# EAGLE design ble_terrain_twister (EAGLE 8.3.2)
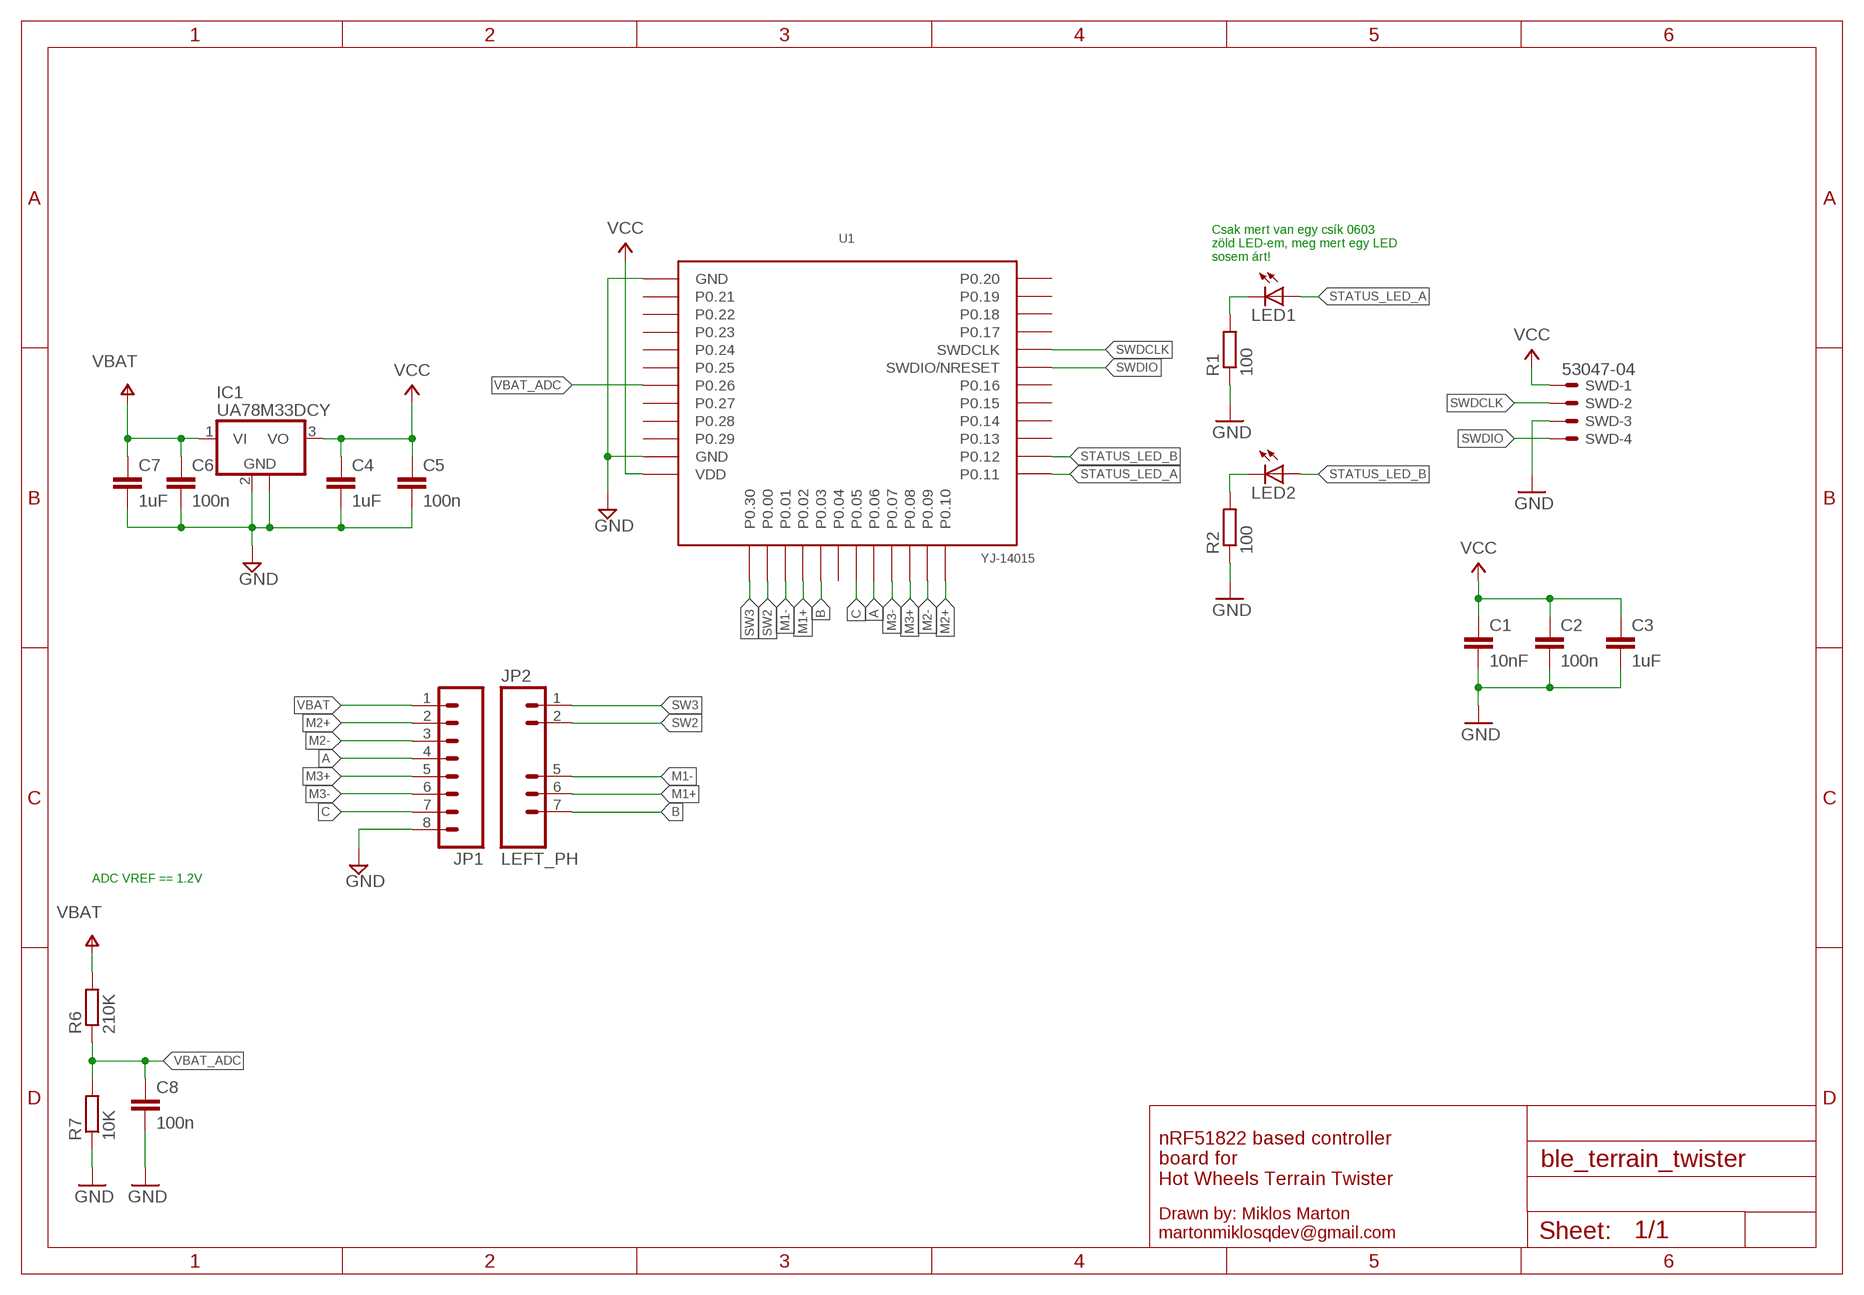
[diagram p0: schematic, sheet 1]

## Parts
C1  10nF  C-EUC0603  [C0603]
C2  100n  C-EUC0603  [C0603]
C3  1uF  C-EUC0603  [C0603]
C4  1uF  C-EUC0603  [C0603]
C5  100n  C-EUC0603  [C0603]
C6  100n  C-EUC0603  [C0603]
C7  1uF  C-EUC0603  [C0603]
C8  100n  C-EUC0603  [C0603]
IC1  UA78M33DCY  [SOT223]
JP1  M081.27MM  [1X08_1.27MM]
JP2  LEFT_PH  [1X08_1.27MM]
LED1  LED0603  [CHIPLED_0603]
LED2  LED0603  [CHIPLED_0603]
R1  100  R-EU_R0603  [R0603]
R2  100  R-EU_R0603  [R0603]
R6  210K  R-EU_R0603  [R0603]
R7  10K  R-EU_R0603  [R0603]
SWD  53047-04  [53047-04]
U1  YJ-14015  [YJ-14015]

## Nets
A: JP1.4 U1.P.06(P0.06)
B: JP2.7 U1.P.03(P0.03)
C: JP1.7 U1.P.05(P0.05)
GND: C1.2 C2.2 C3.2 C4.2 C5.2 C6.2 C7.2 C8.2 IC1.2(GND) IC1.4(GND) JP1.8 R1.1 R2.1 R7.1 SWD.3 U1.GND U1.GND@2(GND)
LED_A_R: LED1.C R1.2
LED_B_R: LED2.C R2.2
M1+: JP2.6 U1.P.02(P0.02)
M1-: JP2.5 U1.P.01(P0.01)
M2+: JP1.2 U1.P.10(P0.10)
M2-: JP1.3 U1.P.09(P0.09)
M3+: JP1.5 U1.P.08(P0.08)
M3-: JP1.6 U1.P.07(P0.07)
STATUS_LED_A: LED1.A U1.P.11(P0.11)
STATUS_LED_B: LED2.A U1.P.12(P0.12)
SW2: JP2.2 U1.P.00(P0.00)
SW3: JP2.1 U1.P.30(P0.30)
SWDCLK: SWD.2 U1.SWDCLK
SWDIO: SWD.4 U1.SWDIO(SWDIO/NRESET)
VBAT: C6.1 C7.1 IC1.1(VI) JP1.1 R6.2
VBAT_ADC: C8.1 R6.1 R7.2 U1.P.26(P0.26)
VCC: C1.1 C2.1 C3.1 C4.1 C5.1 IC1.3(VO) SWD.1 U1.VDD
Unconnected: U1.P.04(P0.04) U1.P.13(P0.13) U1.P.14(P0.14) U1.P.15(P0.15) U1.P.16(P0.16) U1.P.17(P0.17) U1.P.18(P0.18) U1.P.19(P0.19) U1.P.20(P0.20) U1.P.21(P0.21) U1.P.22(P0.22) U1.P.23(P0.23) U1.P.24(P0.24) U1.P.25(P0.25) U1.P.27(P0.27) U1.P.28(P0.28) U1.P.29(P0.29)

## Notes on the sheet
- Csak mert van egy csík 0603 
  zöld LED-em, meg mert egy LED
  sosem árt!
- ADC VREF == 1.2V
- nRF51822 based controller 
  board for 
  Hot Wheels Terrain Twister

## Library data of the parts
C1-C8 = rcl:C-EU: CAPACITOR, European symbol
IC1 = linear:UA78M*: POSITIVE-VOLTAGE REGULATORS Source: http://focus.ti.com/lit/ds/symlink/ua78m33.pdf
JP1 = SparkFun:M08: Header 8 Standard 8-pin 0.1" header. Use with straight break away headers (SKU : PRT-00116), right angle break away headers (PRT-00553), swiss pins (PRT-00743), machine pins (PRT-00117), and female headers (PRT-00115).
JP2 = terrain_twister_control_board_edge:LEFT_PH
LED1 LED2 = CEDT:LED
R1 R2 R6 R7 = rcl:R-EU_: RESISTOR, European symbol
SWD = con-molex:53?-04: CONNECTOR wire to board 1.25 mm (.049 inch) pitch header; MF: WALDOM/MOLEX; MPN: 53047-0410; OC_FARNELL: 9733060; OC_NEWARK: 38C9900
U1 = YJ-14015:YJ-14015

## Board
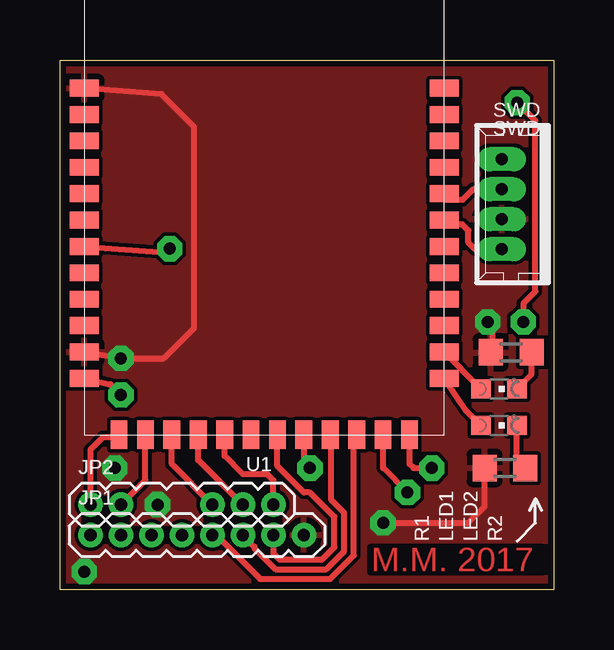
[diagram p1: board, top side]
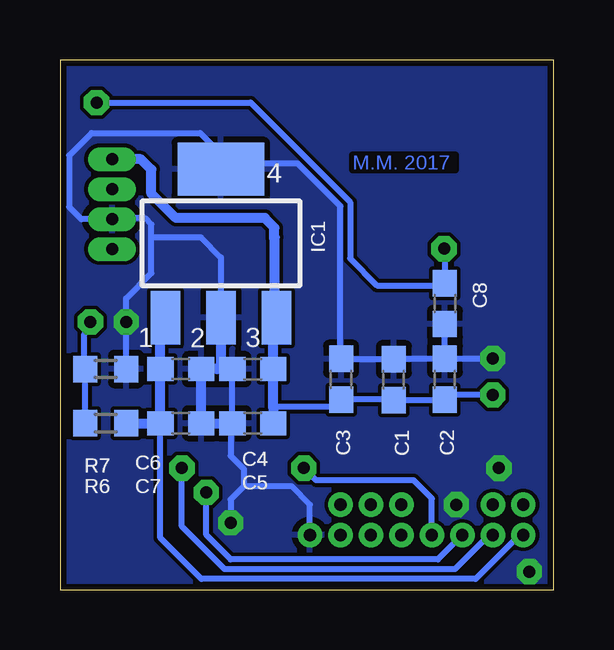
[diagram p2: board, bottom side, seen from below]

Size 20.57 x 22.1 mm. Coordinates in mm from the lower left corner, seen from the top.
Outline: 0,22.1 20.57,22.1 20.57,0 0,0 0,22.1
Copper layers (1*16): Top 0.035mm / dielectric 1.5mm / Bottom 0.035mm
Design rules "dirt_cheap_dirty_boards.v1": minimum track width 5mil, minimum drill 0.3mm, track to track 6mil, track to pad 6mil, pad to pad 6mil, via to via 6mil, smd to smd 0mil, copper to edge 10mil, drill to drill 10mil, minimum pad ring 10mil, minimum via ring 6mil, stop-mask expansion 2mil, vias tented up to drill 25mil, thermal gap 10mil

### Footprints (pad centres in the part's own frame; a part is rotated, then mirrored left to right if it is on the bottom)
C0603 = smd 1.1 x 1: 1 -0.85,0; 2 0.85,0
SOT223 = smd 1.219 x 2.235: 1 -2.311,-3.099; 2 0,-3.099; 3 2.311,-3.099 | smd 3.6 x 2.2: 4 0,3.099
1X08_1.27MM = drill 0.508 pad 1: 1 0,0; 2 1.27,0; 3 2.54,0; 4 3.81,0; 5 5.08,0; 6 6.35,0; 7 7.62,0; 8 8.89,0
1X08_1.27MM' = drill 0.508 pad 1: 1 0,0; 2 1.27,0; 5 5.08,0; 6 6.35,0; 7 7.62,0
CHIPLED_0603 = smd 0.8 x 0.8: A 0,-0.75; C 0,0.75
R0603 = smd 1 x 1.1: 1 -0.85,0; 2 0.85,0
53047-04 = drill 0.5 pad 0.698 long: 1 1.875,0.45; 2 0.625,0.45; 3 -0.625,0.45; 4 -1.875,0.45
YJ-14015 = smd 1.2 x 0.7: GND -7.5,3.45; GND@2 -7.5,14.45; P.11 7.5,2.35; P.12 7.5,3.45; P.13 7.5,4.55; P.14 7.5,5.65; P.15 7.5,6.75; P.16 7.5,7.85; P.17 7.5,11.15; P.18 7.5,12.25; P.19 7.5,13.35; P.20 7.5,14.45; P.21 -7.5,13.35; P.22 -7.5,12.25; P.23 -7.5,11.15; P.24 -7.5,10.05; P.25 -7.5,8.95; P.26 -7.5,7.85; P.27 -7.5,6.75; P.28 -7.5,5.65; P.29 -7.5,4.55; SWDCLK 7.5,10.05; SWDIO 7.5,8.95; VDD -7.5,2.35 | smd 0.7 x 1.2: P.00 -4.95,0; P.01 -3.85,0; P.02 -2.75,0; P.03 -1.65,0; P.04 -0.55,0; P.05 0.55,0; P.06 1.65,0; P.07 2.75,0; P.08 3.85,0; P.09 4.95,0; P.10 6.05,0; P.30 -6.05,0

### Placement (x,y rotation side)
C1  6.67,8.76 90 bottom
C2  4.54,8.78 90 bottom
C3  8.86,8.78 90 bottom
C4  12.54,9.21 180 bottom
C5  12.54,6.95 180 bottom
C6  15.54,9.21 0 bottom
C7  15.54,6.95 0 bottom
C8  4.54,11.94 270 bottom
IC1  13.87,14.45 0 bottom
JP1  1.27,2.29 0 top
JP2  LEFT_PH  [1X08_1.27MM']  1.27,3.56 0 top
LED1  18.29,6.86 270 top
LED2  18.29,8.38 270 top
R1  18.54,5.08 0 top
R2  18.8,9.91 0 top
R6  18.67,6.95 0 bottom
R7  18.67,9.21 180 bottom
SWD  18.86,16.09 90 top
U1  8.51,6.47 0 top

### Tracks (layer width: path | path; a pad name or v marks a point on that pad's centre or on a via)
A  (via drill 0.5 pad 1.05)
  Top 0.254: U1.P.06 10.16,5.33 v10.41,5.08
  Bottom 0.254: JP1.4 5.08,3.81 5.84,4.57 9.91,4.57 v10.41,5.08
B
  Top 0.254: JP2.7 8.89,4.57 8.64,4.83 7.62,4.83 6.86,5.59 U1.P.03
  Top 0.406: U1.P.03
C
  Top 0.254: JP1.7 8.89,1.52 9.14,1.27 10.92,1.27 11.43,1.78 11.43,3.05 10.41,4.06 10.16,4.06 9.06,5.16 U1.P.05
GND  (via drill 0.5 pad 1.05)
  Top 0.254: R2.1 18.03,9.99 18.03,11.18 v17.82,11.18 | R1.1 17.69,3.47 17.02,2.79 v13.46,2.79 | U1.GND@2 4.22,20.67 5.59,19.3 5.59,10.92 4.32,9.65 v2.54,9.65 2.52,9.67 U1.GND
  Bottom 0.254: C4.2 C5.2 13.46,7.13 13.46,5.59 12.91,5.04 12.91,4.32 | R7.1 v17.82,11.18 17.82,12.15 16.76,13.21 16.76,14.71 | C2.2 2.56,9.63 v2.54,9.65 | C2.2 C8.2 | C2.2 6.65,9.63 C1.2 8.85,9.61 C3.2 8.89,9.66 8.89,16 10.67,17.78 15.24,17.78 14.73,17.27 14.15,17.27 IC1.4 13.87,18.19 14.73,19.05 19.26,19.05 20.19,18.11 20.19,15.97 19.69,15.46 SWD.3 18.37,15.49 17.02,15.49 16.76,15.24 16.76,14.71 | JP1.8 10.16,3.56 10.92,4.32 12.91,4.32 | 16.76,14.71 14.71,14.71 13.87,13.87 IC1.2 | 12.91,4.32 13.46,3.77 v13.46,2.79
  Bottom 0.406: 14.19,11.03 IC1.2 13.87,9.38 14.04,9.21 | C4.2 14.04,9.21 | 14.04,9.21 C6.2 C7.2 C5.2 | IC1.4 13.87,18.41
  other vias: 1.02,0.76 2.29,5.08 4.06,3.56
  pour Bottom: 0,22.1 20.57,22.1 20.57,0 0,0
  pour Top: 0,22.1 20.57,22.1 20.57,0 0,0
LED_A_R
  Top 0.254: R1.2 19.04,5.43 LED1.C
LED_B_R
  Top 0.254: LED2.C 19.65,8.99 R2.2
M1+
  Top 0.254: JP2.6 5.76,5.42 U1.P.02
M1-
  Top 0.254: JP2.5 4.66,5.25 U1.P.01
M2+  (via drill 0.5 pad 1.05)
  Top 0.254: U1.P.10 14.56,5.25 14.73,5.08 v15.49,5.08
  Bottom 0.254: JP1.2 2.7,2.29 4.12,0.86 13.72,0.86 15.49,2.64 v15.49,5.08
M2-  (via drill 0.5 pad 1.05)
  Top 0.254: v14.48,4.06 13.46,5.08 U1.P.09
  Bottom 0.254: JP1.3 4.83,1.27 13.46,1.27 14.48,2.29 v14.48,4.06
M3+
  Top 0.254: U1.P.08 12.4,6.51 12.24,6.36 12.24,1.44 11.26,0.46 8.33,0.46 6.51,2.29 JP1.5
M3-
  Top 0.254: U1.P.07 11.3,6.51 11.3,3.75 11.84,3.22 11.84,1.61 11.09,0.86 8.98,0.86 8.1,1.74 8.1,1.8 JP1.6
STATUS_LED_A
  Top 0.254: LED1.A 16.92,7.47 U1.P.11
STATUS_LED_B
  Top 0.254: LED2.A 17.45,8.47 U1.P.12
SW2
  Top 0.254: JP2.2 3.56,4.58 U1.P.00
SW3
  Top 0.254: U1.P.30 2.34,6.35 1.78,6.35 1.27,5.84 JP2.1
SWDCLK
  Top 0.254: SWD.2 17.22,16.71 16.76,16.26 16.03,16.26 U1.SWDCLK
SWDIO
  Top 0.254: SWD.4 17.28,14.21 17.02,14.48 17.02,14.99 16.76,15.24 16.08,15.24 U1.SWDIO
VBAT
  Bottom 0.254: JP1.1 1.43,2.29 3.26,0.46 14.68,0.46 16.39,2.17 C7.1
  Bottom 0.406: C7.1 C6.1 16.39,10.56 15.89,11.06 IC1.1 | 16.68,6.91 C7.1 | R6.2 C7.1
VBAT_ADC  (via drill 0.5 pad 1.05)
  Top 0.254: v19.3,11.18 19.3,11.94 19.81,12.45 19.81,19.56 v19.05,20.32 | U1.P.26 4.42,14.07 v4.57,14.22
  Bottom 0.254: 19.77,8.86 R7.2 | v4.57,14.22 4.54,14.19 C8.1 4.62,12.7 7.37,12.7 8.48,13.82 8.48,16.17 12.63,20.32 v19.05,20.32 | R6.1 19.52,7.21 R7.2 | R7.2 19.56,9.25 19.56,10.67 v19.3,11.18
VCC  (via drill 0.5 pad 1.05)
  Top 0.254: U1.VDD 2.1,8.57 v2.54,8.13
  Bottom 0.254: 11.64,11.71 11.64,11.44 IC1.3 | 11.54,14.71 11.64,14.61 | v2.54,8.13 4.34,8.13 C2.1 4.55,7.91 C1.1 6.69,7.93 C3.1 9.17,7.62 11.69,7.62
  Bottom 0.406: C5.1 11.69,7.62 C4.1 11.69,11.22 IC1.3 11.19,10.98 | 11.64,11.71 11.64,14.61 11.64,15.11 12.04,15.51 15.75,15.51 16.76,16.52 16.76,17.53 17.2,17.96 SWD.1

### Text on the board
Top: M.M. 2017
Bottom: M.M. 2017
_tNames: SWD | U1 | JP2 | JP1 | R1 | LED1 | LED2 | R2
_bNames: IC1 | C8 | C2 | C1 | C3 | C4 | C6 | C5 | C7 | R6 | R7